# EAGLE design double100tqfp (EAGLE 6.6.0)
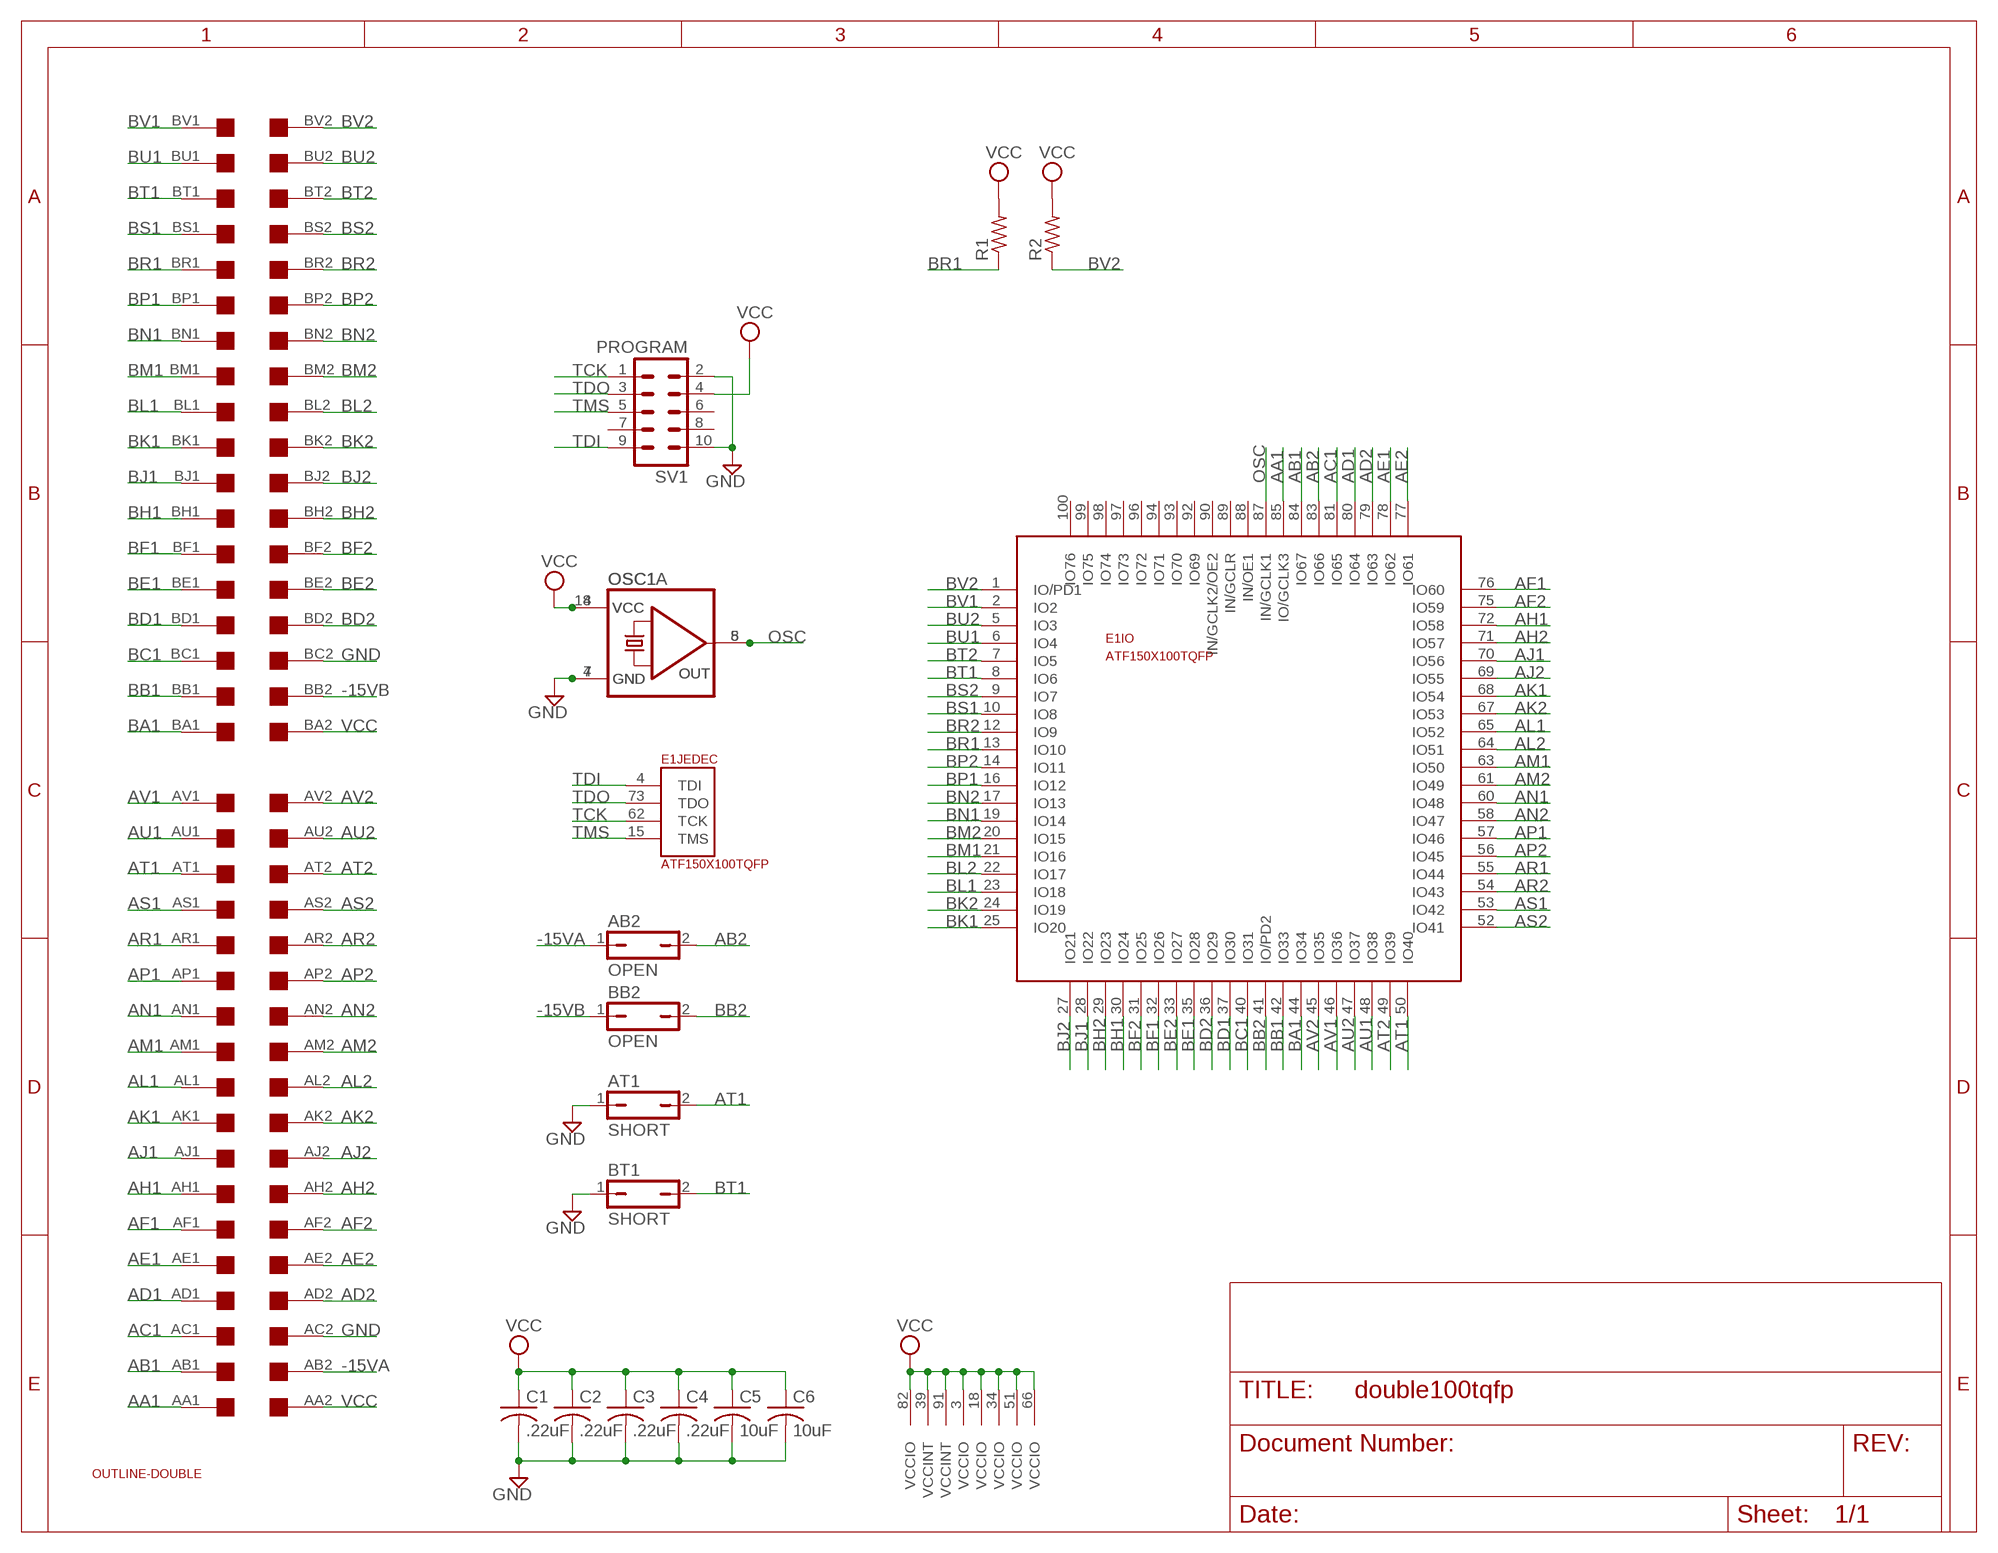
[diagram p0: schematic, sheet 1]

## Parts
AB2  OPEN  JP1Q  [JP1]
AT1  SHORT  JP1Q  [JP1]
BB2  OPEN  JP1Q  [JP1]
BT1  SHORT  JP1Q  [JP1]
C1  .22uF  C-USC0805  [C0805]
C2  .22uF  C-USC0805  [C0805]
C3  .22uF  C-USC0805  [C0805]
C4  .22uF  C-USC0805  [C0805]
C5  10uF  C-USC0805  [C0805]
C6  10uF  C-USC0805  [C0805]
E1  ATF150X100TQFP  [TQFP-100]
OSC1  QG5460  [DIL08S]
OSC1A  QG5860  [DIL14S]
R1  R-US_0207/10  [0207/10]
R2  R-US_0207/10  [0207/10]
SV1  PROGRAM  ML10  [ML10]
U$1  DOUBLE  [EDGE-CON4]
U$3  OUTLINE-DOUBLE  [DOUBLE]

## Nets
-15VA: AB2.1 U$1.AB2
-15VB: BB2.1 U$1.BB2
AA1: E1.85(IO:IO/GCLK3) U$1.AA1
AB1: E1.84(IO:IO67) U$1.AB1
AB2: AB2.2 E1.83(IO:IO66)
AC1: E1.81(IO:IO65) U$1.AC1
AD1: E1.80(IO:IO64) U$1.AD1
AD2: E1.79(IO:IO63) U$1.AD2
AE1: E1.78(IO:IO62) U$1.AE1
AE2: E1.77(IO:IO61) U$1.AE2
AF1: E1.76(IO:IO60) U$1.AF1
AF2: E1.75(IO:IO59) U$1.AF2
AH1: E1.72(IO:IO58) U$1.AH1
AH2: E1.71(IO:IO57) U$1.AH2
AJ1: E1.70(IO:IO56) U$1.AJ1
AJ2: E1.69(IO:IO55) U$1.AJ2
AK1: E1.68(IO:IO54) U$1.AK1
AK2: E1.67(IO:IO53) U$1.AK2
AL1: E1.65(IO:IO52) U$1.AL1
AL2: E1.64(IO:IO51) U$1.AL2
AM1: E1.63(IO:IO50) U$1.AM1
AM2: E1.61(IO:IO49) U$1.AM2
AN1: E1.60(IO:IO48) U$1.AN1
AN2: E1.58(IO:IO47) U$1.AN2
AP1: E1.57(IO:IO46) U$1.AP1
AP2: E1.56(IO:IO45) U$1.AP2
AR1: E1.55(IO:IO44) U$1.AR1
AR2: E1.54(IO:IO43) U$1.AR2
AS1: E1.53(IO:IO42) U$1.AS1
AS2: E1.52(IO:IO41) U$1.AS2
AT1: AT1.2 E1.50(IO:IO40) U$1.AT1
AT2: E1.49(IO:IO39) U$1.AT2
AU1: E1.48(IO:IO38) U$1.AU1
AU2: E1.47(IO:IO37) U$1.AU2
AV1: E1.46(IO:IO36) U$1.AV1
AV2: E1.45(IO:IO35) U$1.AV2
BA1: E1.44(IO:IO34) U$1.BA1
BB1: E1.42(IO:IO33) U$1.BB1
BB2: BB2.2 E1.41(IO:IO/PD2)
BC1: E1.40(IO:IO31) U$1.BC1
BD1: E1.37(IO:IO30) U$1.BD1
BD2: E1.36(IO:IO29) U$1.BD2
BE1: E1.35(IO:IO28) U$1.BE1
BE2: E1.33(IO:IO27) U$1.BE2
BF1: E1.32(IO:IO26) U$1.BF1
BF2: E1.31(IO:IO25) U$1.BF2
BH1: E1.30(IO:IO24) U$1.BH1
BH2: E1.29(IO:IO23) U$1.BH2
BJ1: E1.28(IO:IO22) U$1.BJ1
BJ2: E1.27(IO:IO21) U$1.BJ2
BK1: E1.25(IO:IO20) U$1.BK1
BK2: E1.24(IO:IO19) U$1.BK2
BL1: E1.23(IO:IO18) U$1.BL1
BL2: E1.22(IO:IO17) U$1.BL2
BM1: E1.21(IO:IO16) U$1.BM1
BM2: E1.20(IO:IO15) U$1.BM2
BN1: E1.19(IO:IO14) U$1.BN1
BN2: E1.17(IO:IO13) U$1.BN2
BP1: E1.16(IO:IO12) U$1.BP1
BP2: E1.14(IO:IO11) U$1.BP2
BR1: E1.13(IO:IO10) R1.1 U$1.BR1
BR2: E1.12(IO:IO9) U$1.BR2
BS1: E1.10(IO:IO8) U$1.BS1
BS2: E1.9(IO:IO7) U$1.BS2
BT1: BT1.2 E1.8(IO:IO6) U$1.BT1
BT2: E1.7(IO:IO5) U$1.BT2
BU1: E1.6(IO:IO4) U$1.BU1
BU2: E1.5(IO:IO3) U$1.BU2
BV1: E1.2(IO:IO2) U$1.BV1
BV2: E1.1(IO:IO/PD1) R2.1 U$1.BV2
GND: AT1.1 BT1.1 C1.2 C2.2 C3.2 C4.2 C5.2 C6.2 OSC1.4(GND) OSC1A.7(GND) SV1.2 SV1.10 U$1.AC2 U$1.BC2
OSC: E1.87(IO:IN/GCLK1) OSC1.5(OUT) OSC1A.8(OUT)
TCK: E1.62(JEDEC:TCK) SV1.1
TDI: E1.4(JEDEC:TDI) SV1.9
TDO: E1.73(JEDEC:TDO) SV1.3
TMS: E1.15(JEDEC:TMS) SV1.5
VCC: C1.1 C2.1 C3.1 C4.1 C5.1 C6.1 E1.3(VCCIO) E1.18(VCCIO) E1.34(VCCIO) E1.39(VCCINT) E1.51(VCCIO) E1.66(VCCIO) E1.82(VCCIO) E1.91(VCCINT) OSC1.8(VCC) OSC1A.14(VCC) R1.2 R2.2 SV1.4 U$1.AA2 U$1.BA2
Unconnected: E1.88(IO:IN/OE1) E1.89(IO:IN/GCLR) E1.90(IO:IN/GCLK2/OE2) E1.92(IO:IO69) E1.93(IO:IO70) E1.94(IO:IO71) E1.96(IO:IO72) E1.97(IO:IO73) E1.98(IO:IO74) E1.99(IO:IO75) E1.100(IO:IO76) SV1.6 SV1.7 SV1.8

## Power pins joined to a net without a drawn wire
GND: E1.11(GND) E1.26(GND) E1.38(GND) E1.43(GND) E1.59(GND) E1.74(GND) E1.86(GND) E1.95(GND)

## Library data of the parts
AB2 AT1 BB2 BT1 = jumper:JP1Q: JUMPER
C1-C6 = rcl:C-US: CAPACITOR, American symbol
E1 = atmel-cpld:ATF150X100: ATF150x in 100 pin package.
OSC1 = crystal:QG5460: CRYSTAL RESONATOR; OC_FARNELL: unknown; OC_NEWARK: unknown
OSC1A = crystal:QG5860: CRYSTAL RESONATOR; OC_FARNELL: unknown; OC_NEWARK: unknown
R1 R2 = rcl:R-US_: RESISTOR, American symbol
SV1 = con-harting-ml:ML10: HARTING; OC_FARNELL: unknown; OC_NEWARK: unknown
U$1 = dec-con:DOUBLE: Double-Height DEC board
U$3 = dec-con:OUTLINE-*: Board outlines for DEC boards.

## Net classes
1 Supply: width 0.711 mm

## Board
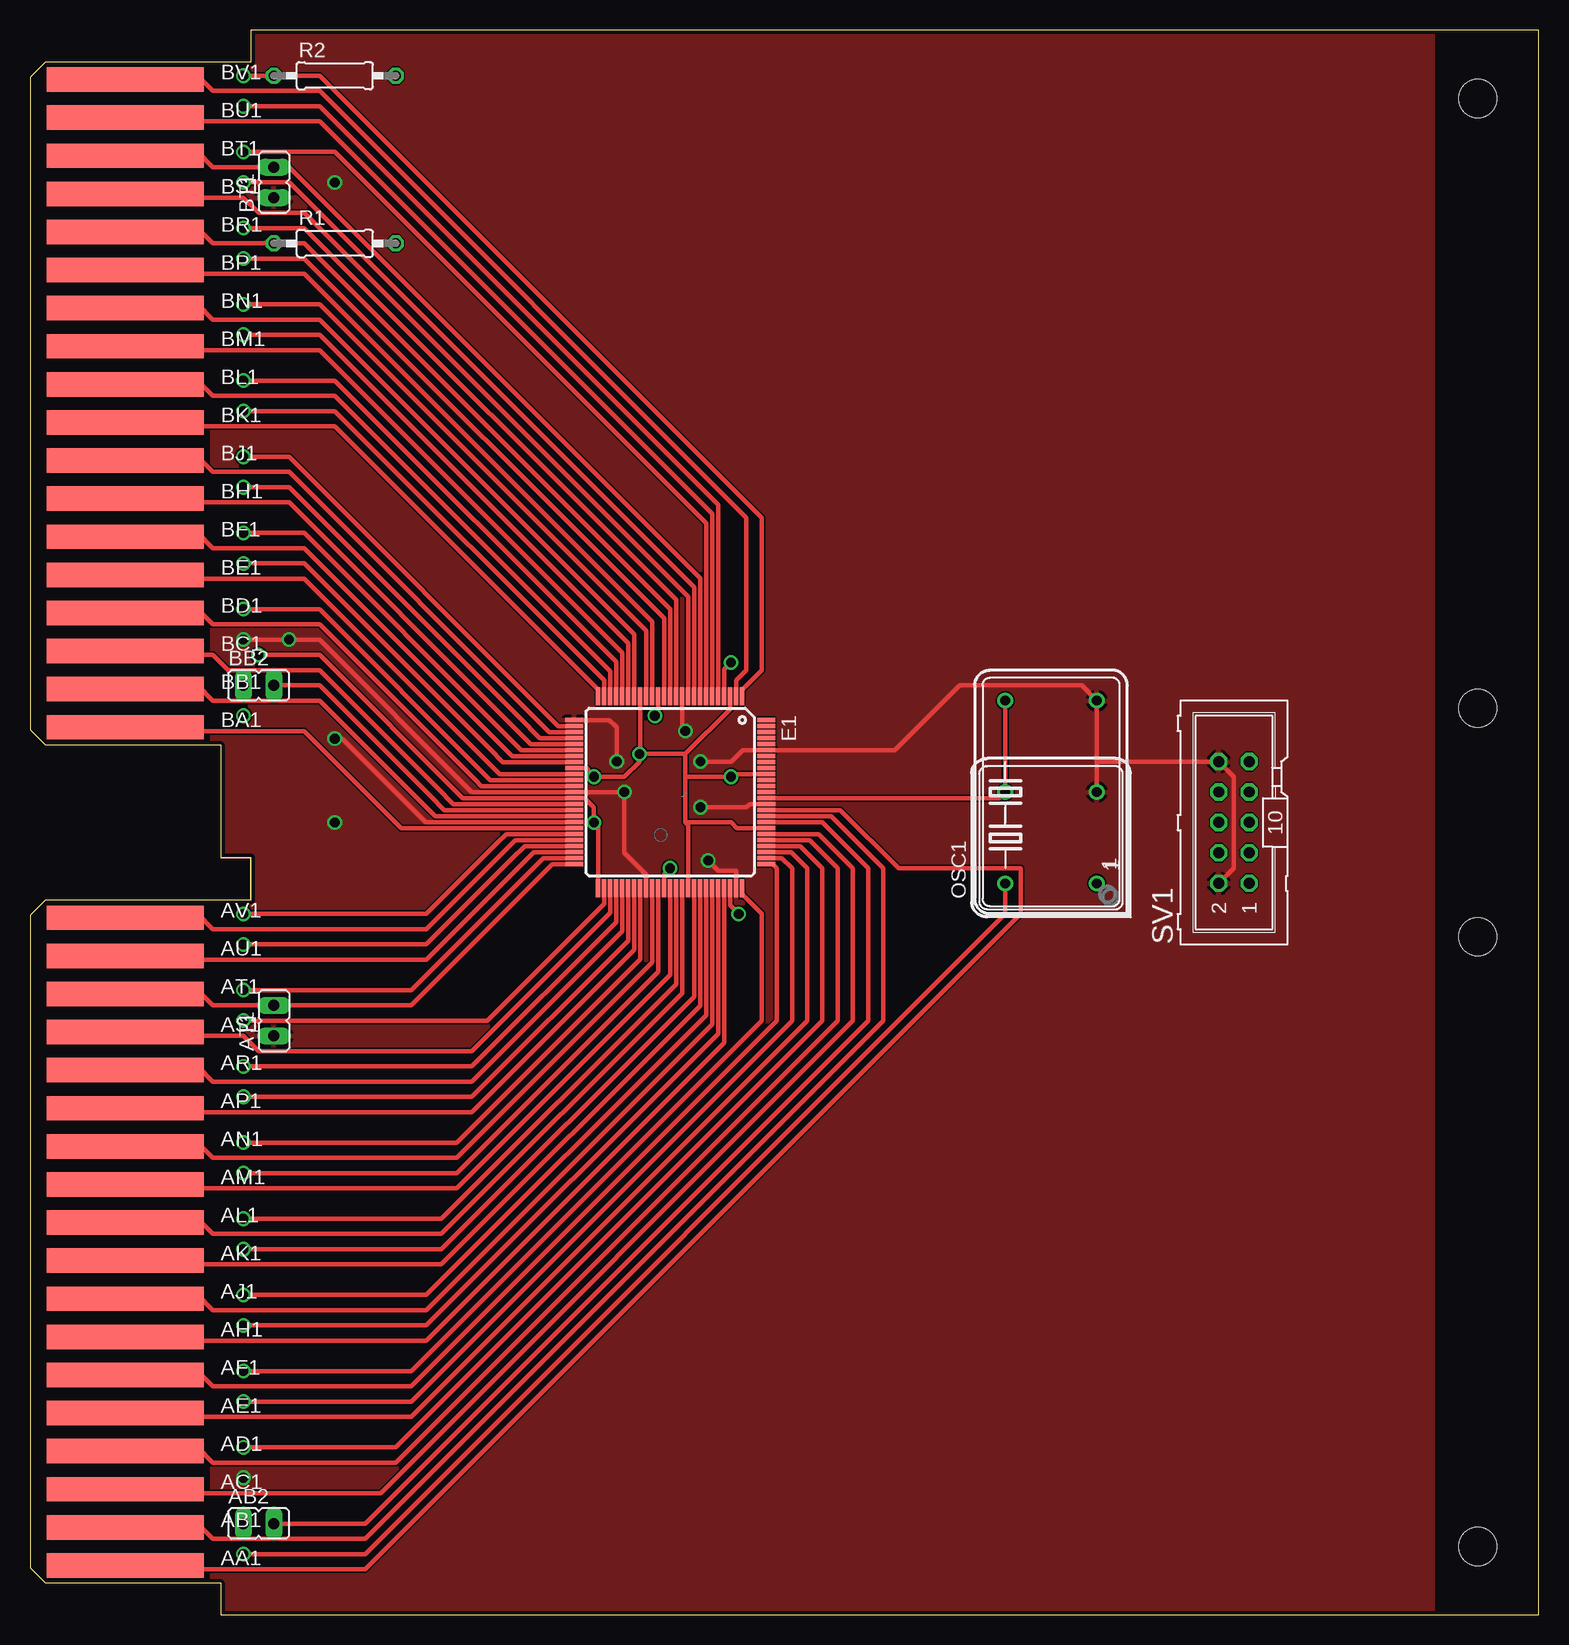
[diagram p1: board, top side]
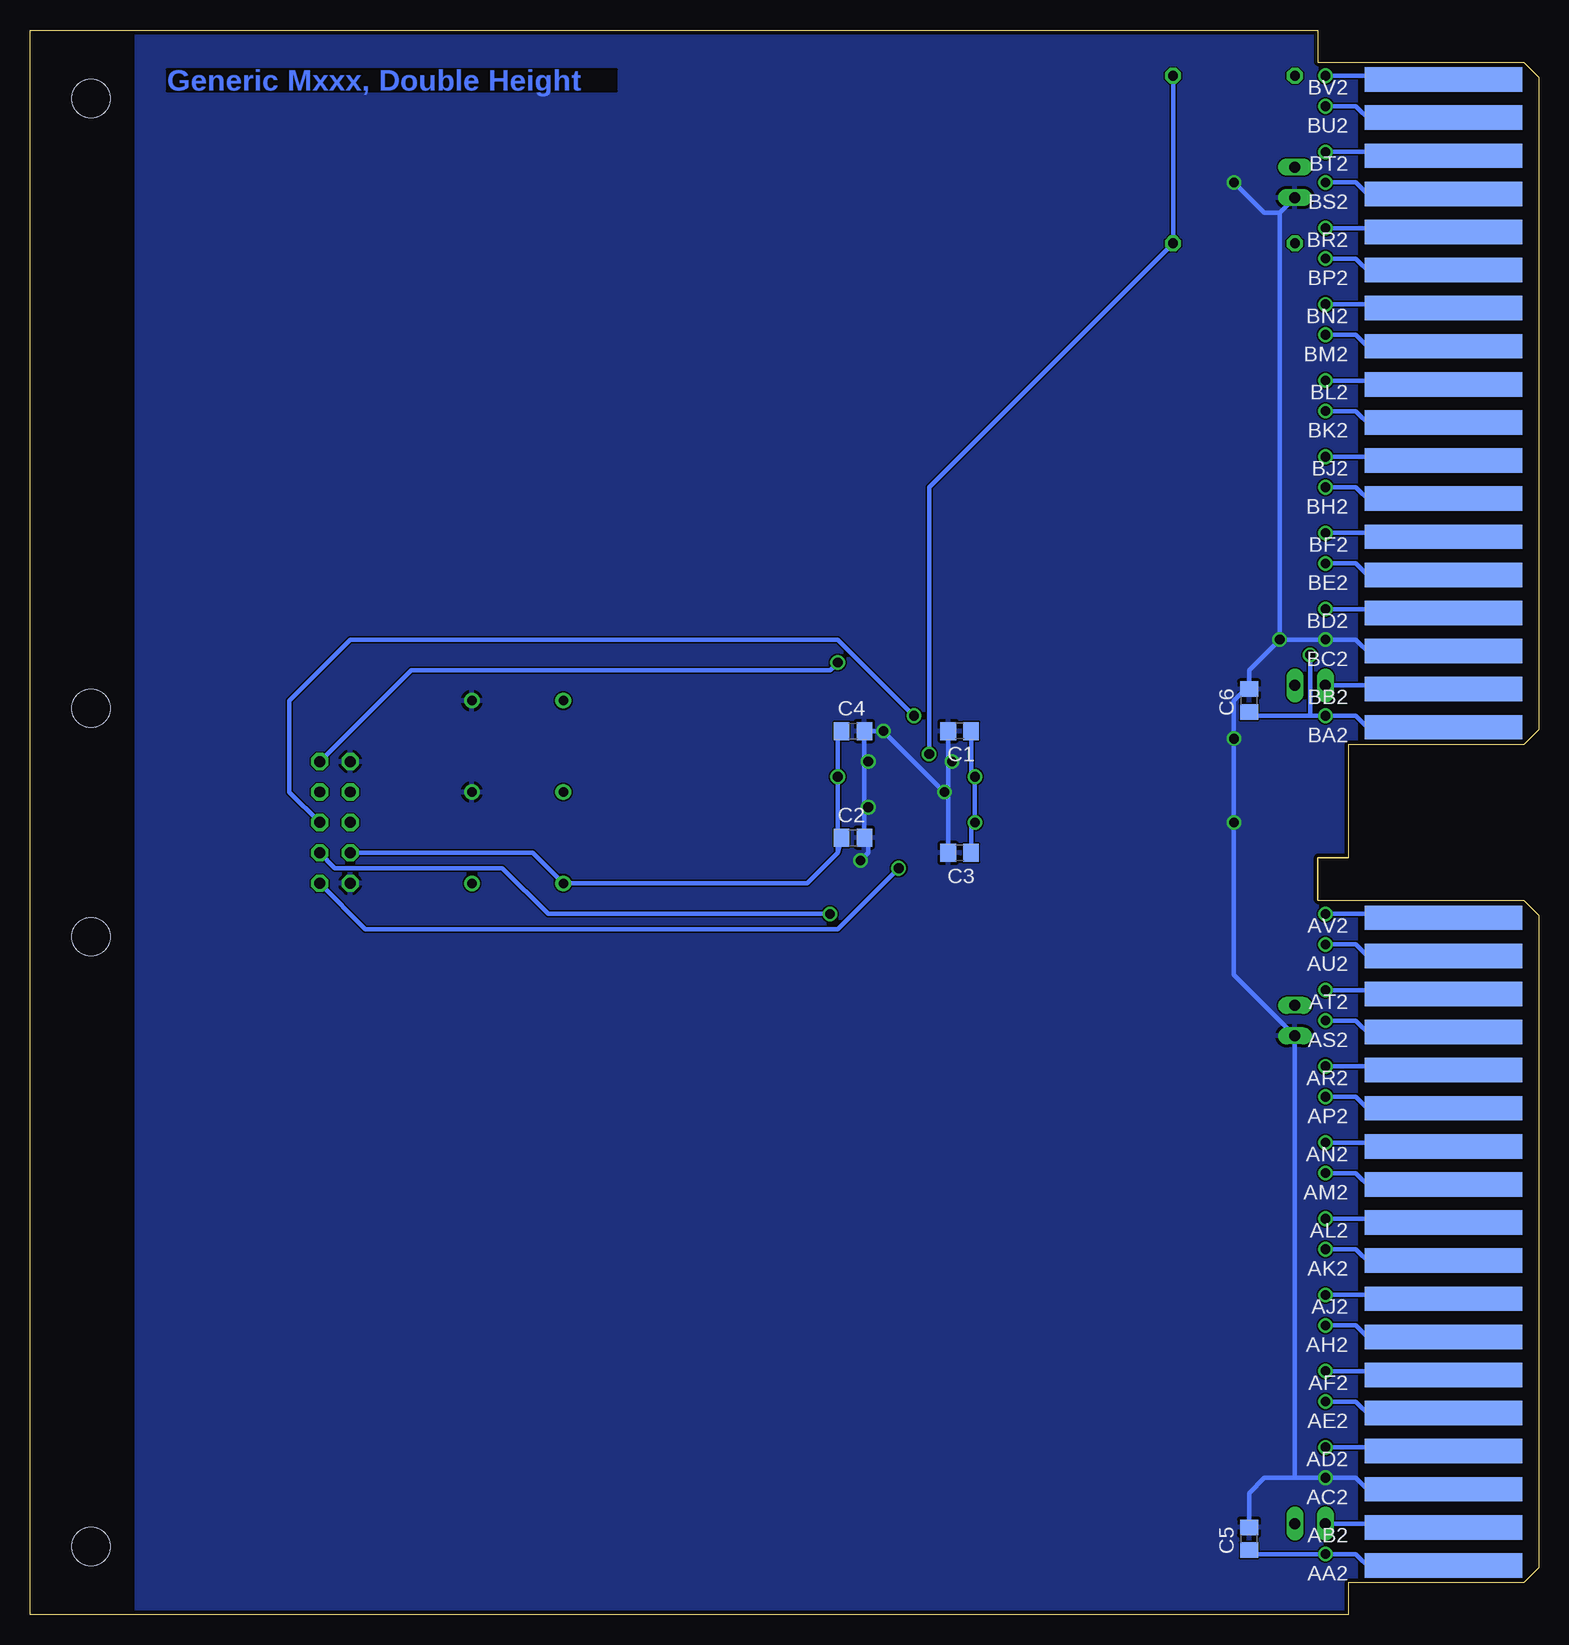
[diagram p2: board, bottom side, seen from below]

Size 125.73 x 132.08 mm. Coordinates in mm from the lower left corner, seen from the top.
Copper layers (1+16): Top 0.035mm / dielectric 1.5mm / Bottom 0.035mm
Design rules "16mils *": minimum track width 13mil, minimum drill 32mil, track to track 5mil, track to pad 5mil, pad to pad 5mil, via to via 10mil, smd to smd 5mil, copper to edge 13mil, drill to drill 10mil, minimum pad ring 10mil, minimum via ring 8mil, stop-mask expansion 0mil, vias tented up to drill 0mil, thermal gap 10mil

### Footprints (pad centres in the part's own frame; a part is rotated, then mirrored left to right if it is on the bottom)
JP1 = drill 0.914 long: 1 0,-1.27; 2 0,1.27
C0805 = smd 1.3 x 1.5: 1 -0.95,0; 2 0.95,0
TQFP-100 = smd 1.5 x 0.35: 1 -8,6; 2 -8,5.5; 3 -8,5; 4 -8,4.5; 5 -8,4; 6 -8,3.5; 7 -8,3; 8 -8,2.5; 9 -8,2; 10 -8,1.5; 11 -8,1; 12 -8,0.5; 13 -8,0; 14 -8,-0.5; 15 -8,-1; 16 -8,-1.5; 17 -8,-2; 18 -8,-2.5; 19 -8,-3; 20 -8,-3.5; 21 -8,-4; 22 -8,-4.5; 23 -8,-5; 24 -8,-5.5; 25 -8,-6; 51 8,-6; 52 8,-5.5; 53 8,-5; 54 8,-4.5; 55 8,-4; 56 8,-3.5; 57 8,-3; 58 8,-2.5; 59 8,-2; 60 8,-1.5; 61 8,-1; 62 8,-0.5; 63 8,0; 64 8,0.5; 65 8,1; 66 8,1.5; 67 8,2; 68 8,2.5; 69 8,3; 70 8,3.5; 71 8,4; 72 8,4.5; 73 8,5; 74 8,5.5; 75 8,6 | smd 0.35 x 1.5: 26 -6,-8; 27 -5.5,-8; 28 -5,-8; 29 -4.5,-8; 30 -4,-8; 31 -3.5,-8; 32 -3,-8; 33 -2.5,-8; 34 -2,-8; 35 -1.5,-8; 36 -1,-8; 37 -0.5,-8; 38 0,-8; 39 0.5,-8; 40 1,-8; 41 1.5,-8; 42 2,-8; 43 2.5,-8; 44 3,-8; 45 3.5,-8; 46 4,-8; 47 4.5,-8; 48 5,-8; 49 5.5,-8; 50 6,-8; 76 6,8; 77 5.5,8; 78 5,8; 79 4.5,8; 80 4,8; 81 3.5,8; 82 3,8; 83 2.5,8; 84 2,8; 85 1.5,8; 86 1,8; 87 0.5,8; 88 0,8; 89 -0.5,8; 90 -1,8; 91 -1.5,8; 92 -2,8; 93 -2.5,8; 94 -3,8; 95 -3.5,8; 96 -4,8; 97 -4.5,8; 98 -5,8; 99 -5.5,8; 100 -6,8
DIL08S = drill 0.813: 1 -3.81,-3.81; 4 3.81,-3.81; 5 3.81,3.81; 8 -3.81,3.81
DIL14S = drill 0.813: 1 -7.62,-3.81; 7 7.62,-3.81; 8 7.62,3.81; 14 -7.62,3.81
0207/10 = drill 0.813 octagon: 1 -5.08,0; 2 5.08,0
ML10 = drill 0.914 octagon: 1 -5.08,-1.27; 2 -5.08,1.27; 3 -2.54,-1.27; 4 -2.54,1.27; 5 0,-1.27; 6 0,1.27; 7 2.54,-1.27; 8 2.54,1.27; 9 5.08,-1.27; 10 5.08,1.27
EDGE-CON4 = smd 13.106 x 2.032: AA1 7.938,4.128; AB1 7.938,7.303; AC1 7.938,10.477; AD1 7.938,13.652; AE1 7.938,16.828; AF1 7.938,20.003; AH1 7.938,23.177; AJ1 7.938,26.352; AK1 7.938,29.527; AL1 7.938,32.703; AM1 7.938,35.877; AN1 7.938,39.053; AP1 7.938,42.227; AR1 7.938,45.403; AS1 7.938,48.578; AT1 7.938,51.752; AU1 7.938,54.928; AV1 7.938,58.102; BA1 7.938,73.978; BB1 7.938,77.153; BC1 7.938,80.328; BD1 7.938,83.502; BE1 7.938,86.677; BF1 7.938,89.853; BH1 7.938,93.028; BJ1 7.938,96.203; BK1 7.938,99.377; BL1 7.938,102.552; BM1 7.938,105.728; BN1 7.938,108.903; BP1 7.938,112.078; BR1 7.938,115.252; BS1 7.938,118.427; BT1 7.938,121.603; BU1 7.938,124.778; BV1 7.938,127.953 | smd 13.106 x 2.032 bottom: AA2 7.938,4.128; AB2 7.938,7.303; AC2 7.938,10.477; AD2 7.938,13.652; AE2 7.938,16.828; AF2 7.938,20.003; AH2 7.938,23.177; AJ2 7.938,26.352; AK2 7.938,29.527; AL2 7.938,32.703; AM2 7.938,35.877; AN2 7.938,39.053; AP2 7.938,42.227; AR2 7.938,45.403; AS2 7.938,48.578; AT2 7.938,51.752; AU2 7.938,54.928; AV2 7.938,58.102; BA2 7.938,73.978; BB2 7.938,77.153; BC2 7.938,80.328; BD2 7.938,83.502; BE2 7.938,86.677; BF2 7.938,89.853; BH2 7.938,93.028; BJ2 7.938,96.203; BK2 7.938,99.377; BL2 7.938,102.552; BM2 7.938,105.728; BN2 7.938,108.903; BP2 7.938,112.078; BR2 7.938,115.252; BS2 7.938,118.427; BT2 7.938,121.603; BU2 7.938,124.778; BV2 7.938,127.953
DOUBLE = hole 3.175: 120.65,56.515; 120.65,5.715; 120.65,75.565; 120.65,126.365

### Placement (x,y rotation side)
AB2  19.05,7.62 270 top
AT1  20.32,49.53 0 top
BB2  19.05,77.47 270 top
BT1  20.32,119.38 0 top
C1  48.26,73.66 180 bottom
C2  57.15,64.77 0 bottom
C3  48.26,63.5 180 bottom
C4  57.15,73.66 0 bottom
C5  24.13,6.35 90 bottom
C6  24.13,76.2 90 bottom
E1  53.34,68.58 270 top
OSC1  85.09,64.77 90 top
OSC1A  85.09,68.58 90 top
R1  25.4,114.3 0 top
R2  25.4,128.27 0 top
SV1  100.33,66.04 90 top
U$1  0,0 0 top
U$3  0,0 0 top

### Tracks (layer width: path | path; a pad name or v marks a point on that pad's centre or on a via)
-15VA
  Bottom 0.356: U$1.AB2 8.26,7.62 AB2.1
-15VB
  Bottom 0.356: U$1.BB2 8.26,77.47 BB2.1
AA1
  Top 0.356: U$1.AA1 8.26,3.81 27.94,3.81 82.55,58.42 82.55,62.23 72.39,62.23 67.54,67.08 E1.85
AB1
  Top 0.356: U$1.AB1 8.26,7.62 13.97,7.62 15.24,6.35 27.94,6.35 71.12,49.53 71.12,62.23 66.77,66.58 E1.84
AB2
  Top 0.356: AB2.2 27.94,7.62 69.85,49.53 69.85,62.23 66,66.08 E1.83
AC1
  Top 0.356: U$1.AC1 8.26,10.16 29.21,10.16 68.58,49.53 68.58,62.23 65.73,65.08 E1.81
AD1
  Top 0.356: U$1.AD1 8.26,13.97 13.97,13.97 15.24,12.7 30.48,12.7 67.31,49.53 67.31,62.23 64.96,64.58 E1.80
AD2  (via drill 0.81)
  Top 0.356: v17.78,13.97 30.48,13.97 66.04,49.53 66.04,62.23 64.19,64.08 E1.79
  Bottom 0.356: U$1.AD2 8.26,13.97 v17.78,13.97
AE1
  Top 0.356: U$1.AE1 8.26,16.51 31.75,16.51 64.77,49.53 64.77,62.23 63.42,63.58 E1.78
AE2  (via drill 0.81)
  Top 0.356: v17.78,17.78 31.75,17.78 63.5,49.53 63.5,62.23 62.65,63.08 E1.77
  Bottom 0.356: U$1.AE2 8.26,16.51 13.97,16.51 15.24,17.78 v17.78,17.78
AF1
  Top 0.356: U$1.AF1 8.26,20.32 13.97,20.32 15.24,19.05 31.75,19.05 62.23,49.53 62.23,62.23 61.88,62.58 E1.76
AF2  (via drill 0.81)
  Top 0.356: v17.78,20.32 31.75,20.32 60.96,49.53 60.96,58.42 59.34,60.04 E1.75
  Bottom 0.356: U$1.AF2 8.26,20.32 v17.78,20.32
AH1
  Top 0.356: U$1.AH1 8.26,22.86 33.02,22.86 57.84,47.68 E1.72
AH2  (via drill 0.81)
  Top 0.356: v17.78,24.13 33.02,24.13 57.34,48.45 E1.71
  Bottom 0.356: U$1.AH2 8.26,22.86 13.97,22.86 15.24,24.13 v17.78,24.13
AJ1
  Top 0.356: U$1.AJ1 8.26,26.67 13.97,26.67 15.24,25.4 33.02,25.4 56.84,49.22 E1.70
AJ2  (via drill 0.81)
  Top 0.356: v17.78,26.67 33.02,26.67 56.34,49.99 E1.69
  Bottom 0.356: U$1.AJ2 8.26,26.67 v17.78,26.67
AK1
  Top 0.356: U$1.AK1 8.26,29.21 34.29,29.21 55.84,50.76 E1.68
AK2  (via drill 0.81)
  Top 0.356: v17.78,30.48 34.29,30.48 55.34,51.53 E1.67
  Bottom 0.356: U$1.AK2 8.26,29.21 13.97,29.21 15.24,30.48 v17.78,30.48
AL1
  Top 0.356: U$1.AL1 8.26,33.02 13.97,33.02 15.24,31.75 34.29,31.75 54.34,51.8 E1.65
AL2  (via drill 0.81)
  Top 0.356: v17.78,33.02 34.29,33.02 53.84,52.57 E1.64
  Bottom 0.356: U$1.AL2 8.26,33.02 v17.78,33.02
AM1
  Top 0.356: U$1.AM1 8.26,35.56 35.56,35.56 53.34,53.34 E1.63
AM2  (via drill 0.81)
  Top 0.356: v17.78,36.83 35.56,36.83 52.34,53.61 E1.61
  Bottom 0.356: U$1.AM2 8.26,35.56 13.97,35.56 15.24,36.83 v17.78,36.83
AN1
  Top 0.356: U$1.AN1 8.26,39.37 13.97,39.37 15.24,38.1 35.56,38.1 51.84,54.38 E1.60
AN2  (via drill 0.81)
  Top 0.356: v17.78,39.37 35.56,39.37 50.84,54.65 E1.58
  Bottom 0.356: U$1.AN2 8.26,39.37 v17.78,39.37
AP1
  Top 0.356: U$1.AP1 8.26,41.91 36.83,41.91 50.34,55.42 E1.57
AP2  (via drill 0.81)
  Top 0.356: v17.78,43.18 36.83,43.18 49.84,56.19 E1.56
  Bottom 0.356: U$1.AP2 8.26,41.91 13.97,41.91 15.24,43.18 v17.78,43.18
AR1
  Top 0.356: U$1.AR1 8.26,45.72 13.97,45.72 15.24,44.45 36.83,44.45 49.34,56.96 E1.55
AR2  (via drill 0.81)
  Top 0.356: v17.78,45.72 36.83,45.72 48.84,57.73 E1.54
  Bottom 0.356: U$1.AR2 8.26,45.72 v17.78,45.72
AS1
  Top 0.356: U$1.AS1 8.26,48.26 17.78,48.26 19.05,46.99 36.83,46.99 48.34,58.5 E1.53
AS2  (via drill 0.81)
  Top 0.356: v17.78,49.53 38.1,49.53 47.84,59.27 E1.52
  Bottom 0.356: U$1.AS2 8.26,48.26 13.97,48.26 15.24,49.53 v17.78,49.53
AT1
  Top 0.356: U$1.AT1 8.26,52.07 13.97,52.07 15.24,50.8 AT1.2 31.75,50.8 43.53,62.58 E1.50
AT2  (via drill 0.81)
  Top 0.356: v17.78,52.07 31.75,52.07 42.76,63.08 E1.49
  Bottom 0.356: U$1.AT2 8.26,52.07 v17.78,52.07
AU1
  Top 0.356: U$1.AU1 8.26,54.61 33.02,54.61 40.82,62.41 41.99,63.58 E1.48
AU2  (via drill 0.81)
  Top 0.356: v17.78,55.88 33.02,55.88 40.2,63.05 41.22,64.08 E1.47
  Bottom 0.356: U$1.AU2 8.26,54.61 13.97,54.61 15.24,55.88 v17.78,55.88
AV1
  Top 0.356: U$1.AV1 8.26,58.42 13.97,58.42 15.24,57.15 33.02,57.15 39.58,63.7 40.45,64.58 E1.46
AV2  (via drill 0.81)
  Top 0.356: v17.78,58.42 33.02,58.42 38.96,64.36 39.68,65.08 E1.45
  Bottom 0.356: U$1.AV2 8.26,58.42 v17.78,58.42
BA1
  Top 0.356: U$1.BA1 8.26,73.66 22.86,73.66 30.94,65.58 E1.44
BB1
  Top 0.356: U$1.BB1 8.26,77.47 13.97,77.47 15.24,76.2 24.13,76.2 32.76,67.58 33.75,66.58 E1.42
BB2
  Top 0.356: BB2.2 24.13,77.47 33.38,68.22 34.52,67.08 E1.41
BC1
  Top 0.356: U$1.BC1 8.26,80.01 15.24,80.01 16.51,78.74 24.13,78.74 34,68.88 35.29,67.58 E1.40
BD1
  Top 0.356: U$1.BD1 8.26,83.82 13.97,83.82 15.24,82.55 24.13,82.55 37.13,69.56 37.6,69.08 E1.37
BD2  (via drill 0.81)
  Top 0.356: v17.78,83.82 24.13,83.82 37.75,70.2 38.37,69.58 E1.36
  Bottom 0.356: U$1.BD2 8.26,83.82 v17.78,83.82
BE1
  Top 0.356: U$1.BE1 8.26,86.36 22.86,86.36 38.37,70.86 39.14,70.08 E1.35
BE2  (via drill 0.81)
  Top 0.356: v17.78,87.63 22.86,87.63 38.34,72.16 39.41,71.08 E1.33
  Bottom 0.356: U$1.BE2 8.26,86.36 13.97,86.36 15.24,87.63 v17.78,87.63
BF1
  Top 0.356: U$1.BF1 8.26,90.17 13.97,90.17 15.24,88.9 22.86,88.9 38.96,72.81 40.18,71.58 E1.32
BF2  (via drill 0.81)
  Top 0.356: v17.78,90.17 22.86,90.17 39.58,73.45 40.95,72.08 E1.31
  Bottom 0.356: U$1.BF2 8.26,90.17 v17.78,90.17
BH1
  Top 0.356: U$1.BH1 8.26,92.71 21.59,92.71 40.2,74.11 41.72,72.58 E1.30
BH2  (via drill 0.81)
  Top 0.356: v17.78,93.98 21.59,93.98 40.82,74.75 42.49,73.08 E1.29
  Bottom 0.356: U$1.BH2 8.26,92.71 13.97,92.71 15.24,93.98 v17.78,93.98
BJ1
  Top 0.356: U$1.BJ1 8.26,96.52 13.97,96.52 15.24,95.25 21.59,95.25 43.26,73.58 E1.28
BJ2  (via drill 0.81)
  Top 0.356: v17.78,96.52 21.59,96.52 44.03,74.08 E1.27
  Bottom 0.356: U$1.BJ2 8.26,96.52 v17.78,96.52
BK1
  Top 0.356: U$1.BK1 8.26,99.06 25.4,99.06 47.34,77.12 E1.25
BK2  (via drill 0.81)
  Top 0.356: v17.78,100.33 25.4,100.33 47.84,77.89 E1.24
  Bottom 0.356: U$1.BK2 8.26,99.06 13.97,99.06 15.24,100.33 v17.78,100.33
BL1
  Top 0.356: U$1.BL1 8.26,102.87 13.97,102.87 15.24,101.6 25.4,101.6 48.34,78.66 E1.23
BL2  (via drill 0.81)
  Top 0.356: v17.78,102.87 25.4,102.87 48.84,79.43 E1.22
  Bottom 0.356: U$1.BL2 8.26,102.87 v17.78,102.87
BM1
  Top 0.356: U$1.BM1 8.26,105.41 24.13,105.41 49.34,80.2 E1.21
BM2  (via drill 0.81)
  Top 0.356: v17.78,106.68 24.13,106.68 49.84,80.97 E1.20
  Bottom 0.356: U$1.BM2 8.26,105.41 13.97,105.41 15.24,106.68 v17.78,106.68
BN1
  Top 0.356: U$1.BN1 8.26,109.22 13.97,109.22 15.24,107.95 24.13,107.95 50.34,81.74 E1.19
BN2  (via drill 0.81)
  Top 0.356: v17.78,109.22 24.13,109.22 51.34,82.01 E1.17
  Bottom 0.356: U$1.BN2 8.26,109.22 v17.78,109.22
BP1
  Top 0.356: U$1.BP1 8.26,111.76 22.86,111.76 51.84,82.78 E1.16
BP2  (via drill 0.81)
  Top 0.356: v17.78,113.03 22.86,113.03 52.84,83.05 E1.14
  Bottom 0.356: U$1.BP2 8.26,111.76 13.97,111.76 15.24,113.03 v17.78,113.03
BR1
  Top 0.356: U$1.BR1 8.26,115.57 13.97,115.57 15.24,114.3 R1.1 22.86,114.3 53.34,83.82 E1.13
BR2  (via drill 0.81)
  Top 0.356: v17.78,115.57 22.86,115.57 53.84,84.59 E1.12
  Bottom 0.356: U$1.BR2 8.26,115.57 v17.78,115.57
BS1
  Top 0.356: U$1.BS1 8.26,118.11 17.78,118.11 19.05,116.84 22.86,116.84 54.84,84.86 E1.10
BS2  (via drill 0.81)
  Top 0.356: v17.78,119.38 21.59,119.38 55.34,85.63 E1.9
  Bottom 0.356: U$1.BS2 8.26,118.11 13.97,118.11 15.24,119.38 v17.78,119.38
BT1
  Top 0.356: U$1.BT1 8.26,121.92 13.97,121.92 15.24,120.65 BT1.2 21.59,120.65 55.84,86.4 E1.8
BT2  (via drill 0.81)
  Top 0.356: v17.78,121.92 25.4,121.92 56.34,90.98 E1.7
  Bottom 0.356: U$1.BT2 8.26,121.92 v17.78,121.92
BU1
  Top 0.356: U$1.BU1 8.26,124.46 24.13,124.46 56.84,91.75 E1.6
BU2  (via drill 0.81)
  Top 0.356: v17.78,125.73 24.13,125.73 57.34,92.52 E1.5
  Bottom 0.356: U$1.BU2 8.26,124.46 13.97,124.46 15.24,125.73 v17.78,125.73
BV1
  Top 0.356: U$1.BV1 8.26,128.27 13.97,128.27 15.24,127 24.13,127 59.69,91.44 59.69,78.74 58.84,77.89 E1.2
BV2  (via drill 0.81)
  Top 0.356: v17.78,128.27 R2.1 24.13,128.27 60.96,91.44 60.96,78.74 59.34,77.12 E1.1
  Bottom 0.356: U$1.BV2 8.26,128.27 v17.78,128.27
GND  (via drill 0.81)
  Top 0.356: 88.9,71.12 OSC1A.7 87.63,77.47 77.47,77.47 72.08,72.08 E1.95 59.38,72.08 58.42,71.12 v55.88,71.12 | SV1.2 100.33,62.23 100.33,69.85 SV1.10 88.9,71.12 | OSC1.4 88.9,71.12 | v17.78,81.28 v21.59,81.28 24.13,81.28 36.83,68.58 E1.38 v49.53,68.58 49.53,63.5 51.34,61.69 E1.59 | E1.74 58.84,62.02 57.37,62.02 v56.52,62.87 | E1.26 48.29,74.58 48.9,73.97 v48.9,71.12 | v54.61,73.66 54.34,73.93 E1.11 | v55.88,67.31 59.69,67.31 59.96,67.58 E1.86 | v25.4,73.03 26.04,73.03 32.98,66.08 E1.43
  Bottom 0.356: U$1.BC2 8.26,80.01 13.97,80.01 15.24,81.28 v17.78,81.28 v21.59,81.28 | v21.59,81.28 24.13,78.74 C6.2 24.45,77.15 25.4,76.2 v25.4,73.03 v25.4,66.04 25.4,53.34 AT1.1 20.32,11.43 | U$1.AC2 8.26,10.16 13.97,10.16 15.24,11.43 v17.78,11.43 20.32,11.43 | 20.32,11.43 22.86,11.43 24.13,10.16 C5.2 | v21.59,81.28 21.59,116.84 | 21.59,116.84 BT1.1 | 56.2,65.72 C2.2 | 56.2,71.12 C4.2 v54.61,73.66 v49.53,68.58 | 56.2,71.12 56.2,67.31 | 56.2,67.31 C2.2 | v49.53,68.58 49.21,68.26 C3.2 | v49.53,68.58 49.21,68.9 49.21,71.12 | 49.21,71.12 C1.2 | v55.88,71.12 56.2,71.12 | v55.88,67.31 56.2,67.31 | C2.2 55.88,64.45 55.88,63.5 v56.52,62.87 | v25.4,119.38 22.86,116.84 21.59,116.84 | v48.9,71.12 49.21,71.12
  pour Bottom: 15.24,0 15.24,132.08 116.84,132.08 116.84,0
  pour Top: 15.24,0 15.24,132.08 116.84,132.08 116.84,0
OSC
  Top 0.356: OSC1A.8 OSC1.5 80.78,68.08 E1.87
TCK  (via drill 0.81)
  Top 0.356: v53.34,62.23 52.84,61.73 E1.62
  Bottom 0.356: SV1.1 97.79,57.15 58.42,57.15 v53.34,62.23
TDI  (via drill 0.81)
  Top 0.356: v58.42,79.38 57.84,78.8 E1.4
  Bottom 0.356: SV1.9 93.98,78.74 59.06,78.74 v58.42,79.38
TDO  (via drill 0.81)
  Top 0.356: v59.06,58.42 58.34,59.13 E1.73
  Bottom 0.356: SV1.3 100.33,62.23 86.36,62.23 82.55,58.42 v59.06,58.42
TMS  (via drill 0.81)
  Top 0.356: v52.07,74.93 52.34,75.2 E1.15
  Bottom 0.356: SV1.5 104.14,68.58 104.14,76.2 99.06,81.28 58.42,81.28 v52.07,74.93
VCC  (via drill 0.81)
  Top 0.356: v17.78,5.08 27.94,5.08 81.28,58.42 OSC1.8 | v19.05,80.01 24.13,80.01 36.06,68.08 E1.39 46.22,68.08 46.99,67.31 v46.99,66.04 47.34,65.69 E1.51 | E1.82 58.88,65.58 58.42,66.04 54.61,66.04 | v58.42,69.85 58.65,70.08 E1.91 | v58.42,69.85 58.34,69.93 | v58.42,69.85 54.61,69.85 | 54.61,69.85 54.61,66.04 | E1.34 46.45,70.58 v46.99,69.85 49.53,69.85 50.8,71.12 v50.8,71.75 50.84,71.8 | 54.61,69.85 54.61,71.75 | 54.61,71.75 58.34,75.48 E1.3 | 50.84,71.8 E1.18 | 50.84,71.8 51.52,71.75 54.61,71.75 | 54.61,66.04 54.84,65.81 E1.66
  Bottom 0.356: SV1.4 83.82,63.5 OSC1.8 60.96,60.96 58.42,63.5 | U$1.BA2 8.26,73.66 13.97,73.66 15.24,74.93 v17.78,74.93 | v17.78,74.93 18.1,75.25 | U$1.AA2 8.26,3.81 13.97,3.81 15.24,5.08 v17.78,5.08 24.13,5.08 C5.1 | v17.78,74.93 19.05,74.93 | 19.05,74.93 v19.05,80.01 | 19.05,74.93 24.13,74.93 C6.1 | R2.2 R1.2 50.8,93.98 v50.8,71.75 | 58.42,63.5 C2.1 | 58.42,63.5 v58.42,69.85 58.42,73.66 C4.1 | 46.99,73.34 C1.1 47.31,70.17 v46.99,69.85 v46.99,66.04 47.31,65.72 C3.1

### Text on the board
Bottom: Generic Mxxx, Double Height